# EAGLE design USBSocket_Type6_v1.0 (EAGLE 9.6.2)
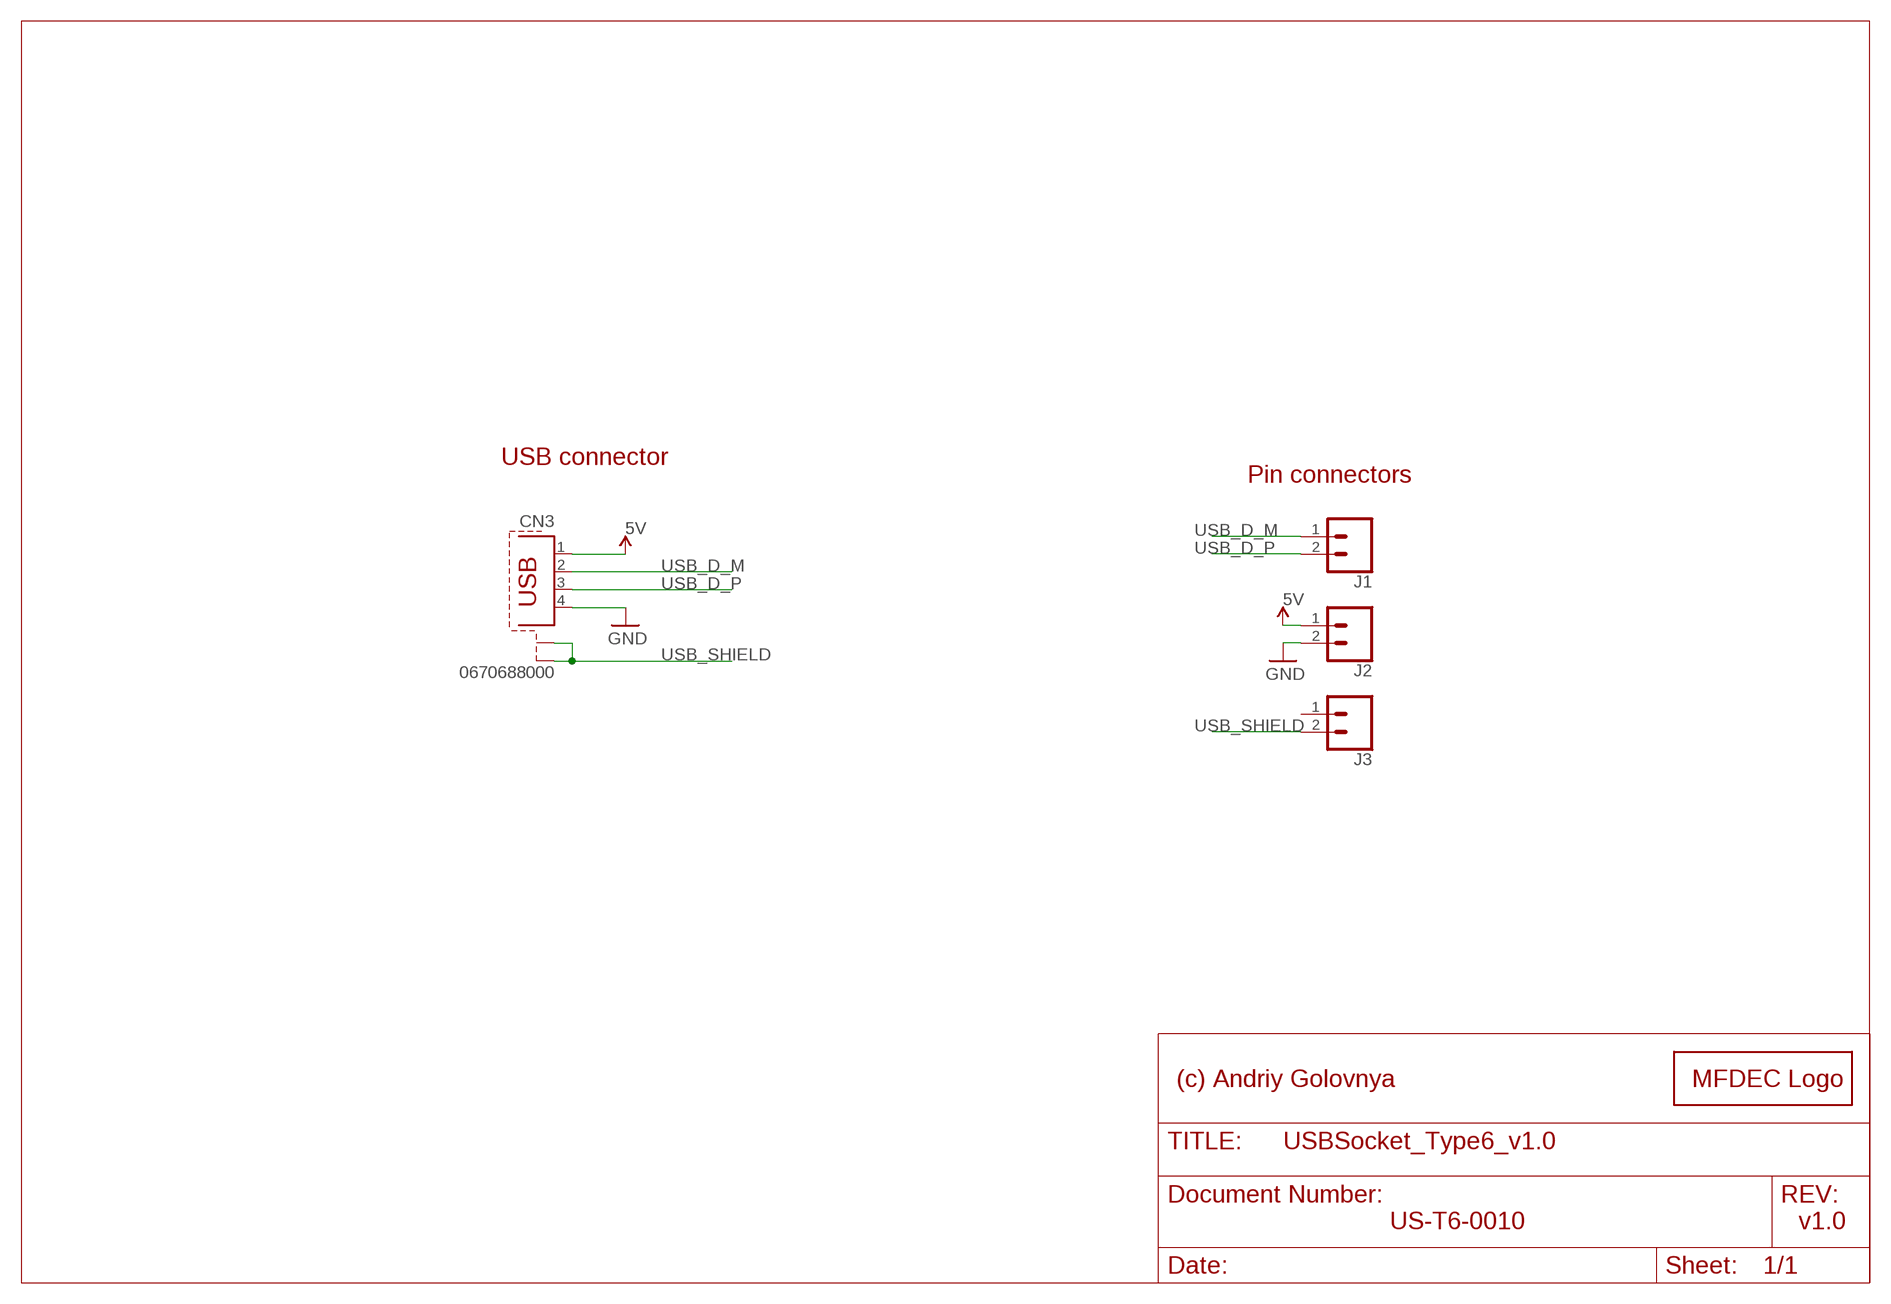
[diagram p0: schematic, sheet 1]

## Parts
CN3  0670688000  PN61729-S  [PN61729-S]
J1  CONN_02  [1X02]
J2  CONN_02  [1X02]
J3  CONN_02  [1X02]
LOGO1  MFDECLOGO_L_10MM  [MFDEC_L_10MM]

## Nets
5V [POWER]: CN3.1 J2.1
GND [POWER]: CN3.4 J2.2
USB_D_M [XUSB]: CN3.2 J1.1
USB_D_P [XUSB]: CN3.3 J1.2
USB_SHIELD: CN3.S1 CN3.S2 J3.2
Unconnected: J3.1

## Notes on the sheet
- USB connector
- Pin connectors
- (c) Andriy Golovnya
- US-T6-0010 | v1.0

## Library data of the parts
CN3 = con-berg:PN61729-S: BERG USB connector; OC_FARNELL: unknown; OC_NEWARK: unknown
J1-J3 = SparkFun-Connectors:CONN_02: Multi connection point. Often used as Generic Header-pin footprint for 0.1 inch spaced/style header connections On any of the 0.1 inch spaced packages, you can populate with these: Break Away Headers - Straight <https://www.sparkfun.com/products/116> (PRT-00116) Break Away Male Headers - Right Angle <https://www.sparkfun.com/products/553> (PRT-00553) Female Headers <https://www.sparkfun.com/products/115> (PRT-00115) Break Away Headers - Machine Pin <https://www.sparkfun.com/products/117> (PRT-00117) Break Away Female Headers - Swiss Machine Pin <https://www.sparkfun.com/products/743> (PRT-00743) For SCREWTERMINALS and SPRING TERMINALS visit here: Screw Terimnals on SparkFun.com <https://www.sparkfun.com/search/results?term=Screw+Terminals> (5mm/3.5mm/2.54mm spacing) This device is also useful as a general connection point to wire up your design to another part of your project. Our various solder wires solder well into these plated through hole pads. Hook-Up Wire - Assortment (Stranded, 22 AWG) <https://www.sparkfun.com/products/11375> (PRT-11375) Hook-Up Wire - Assortment (Solid Core, 22 AWG) <https://www.sparkfun.com/products/11367> (PRT-11367) View the entire wire category on our website here <https://www.sparkfun.com/categories/141> Special notes: Molex polarized connector foot print use with: PRT-08233 with associated crimp pins and housings. 2.54_SCREWTERM for use with PRT-10571. 3.5mm Screw Terminal footprints for PRT-08084 5mm Screw Terminal footprints for use with PRT-08432
LOGO1 = _my_logos:MFDECLOGO: Midnight Fog - Digital Eye Candy LOGO

## Net classes
1 XUSB: width 0.305 mm
2 USB: width 0.305 mm
3 POWER: width 0.305 mm

## Board
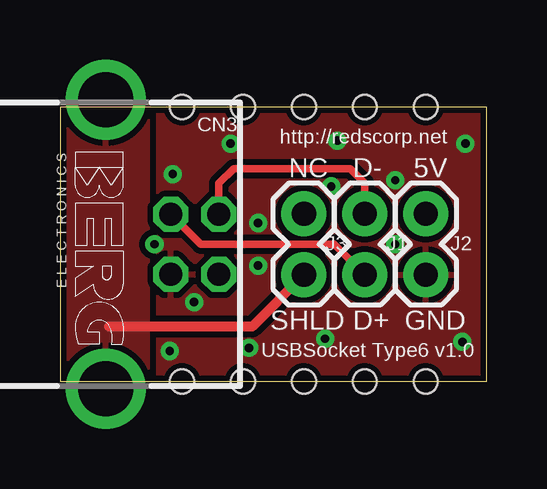
[diagram p1: board, top side]
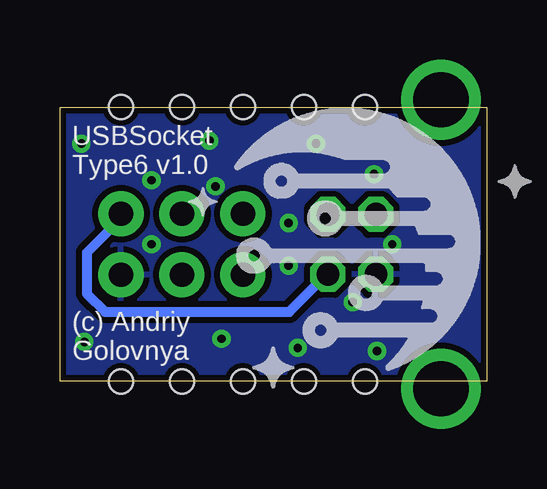
[diagram p2: board, bottom side, seen from below]

Size 17.78 x 11.43 mm. Coordinates in mm from the lower left corner, seen from the top.
Outline: 0,0 17.78,0 17.78,11.43 0,11.43 0,0
Copper layers (1*16): Top 0.035mm / dielectric 1.5mm / Bottom 0.035mm
Design rules "default *": minimum track width 6mil, minimum drill 0.35mm, track to track 6mil, track to pad 6mil, pad to pad 6mil, via to via 6mil, smd to smd 6mil, copper to edge 10mil, drill to drill 6mil, minimum pad ring 10mil, minimum via ring 8mil, stop-mask expansion 4mil, vias tented up to drill 20mil, thermal gap 10mil
Holes 1 mm at 15.24,0 12.7,0 10.16,0 7.62,0 5.08,0 5.08,11.43 7.62,11.43 10.16,11.43 12.7,11.43 15.24,11.43

### Footprints (pad centres in the part's own frame; a part is rotated, then mirrored left to right if it is on the bottom)
PN61729-S = drill 0.95 octagon: 1 1.25,4.71; 2 -1.25,4.71; 3 -1.25,2.71; 4 1.25,2.71 | drill 2.3 pad 2.9: S1 -6.02,0; S2 6.02,0
1X02 = drill 1.016 pad 1.88: 1 0,0; 2 2.54,0

### Placement (x,y rotation side)
CN3  1.91,5.71 270 top
J1  12.7,6.99 270 top
J2  15.24,6.99 270 top
J3  10.16,6.99 270 top
LOGO1  -2.67,12.32 180 bottom

### Tracks (layer width: path | path; a pad name or v marks a point on that pad's centre or on a via)
5V
  Bottom 0.406: CN3.1 6.66,4.46 8.23,2.9 15.9,2.9 16.66,3.65 16.66,5.36 15.24,6.79 J2.1
GND  (via drill 0.35)
  other vias: 11.3,8.13 7.11,9.91 16.76,1.65 16.89,9.91 11.05,1.78 11.56,10.03 3.94,5.71 5.59,3.3 8.26,6.6 8.26,4.83 13.97,5.71 7.87,1.4 13.97,8.38 4.7,8.64 4.57,1.27
  pour Top (isolate 0.254, rank 2): 0,0 23.88,0 23.88,11.43 0,11.43
  pour Bottom (isolate 0.254, rank 2): 0,0 20.57,0 20.57,11.43 0,11.43
USB_D_M
  Top 0.305: J1.1 12.7,8.26 12.09,8.87 7.23,8.87 6.62,8.25 CN3.2
USB_D_P
  Top 0.305: J1.2 11.43,5.71 5.87,5.71 CN3.3
USB_SHIELD
  Top 0.406: 2.03,2.29 8,2.29 J3.2
  pour Top (isolate 0.254): 3.68,0 3.68,11.43 0,11.43 0,0

### Text on the board
tPlace: http://redscorp.net | NC | D- | 5V | SHLD | D+ | GND | USBSocket Type6 v1.0
bPlace: USBSocket / Type6 v1.0 | (c) Andriy / Golovnya